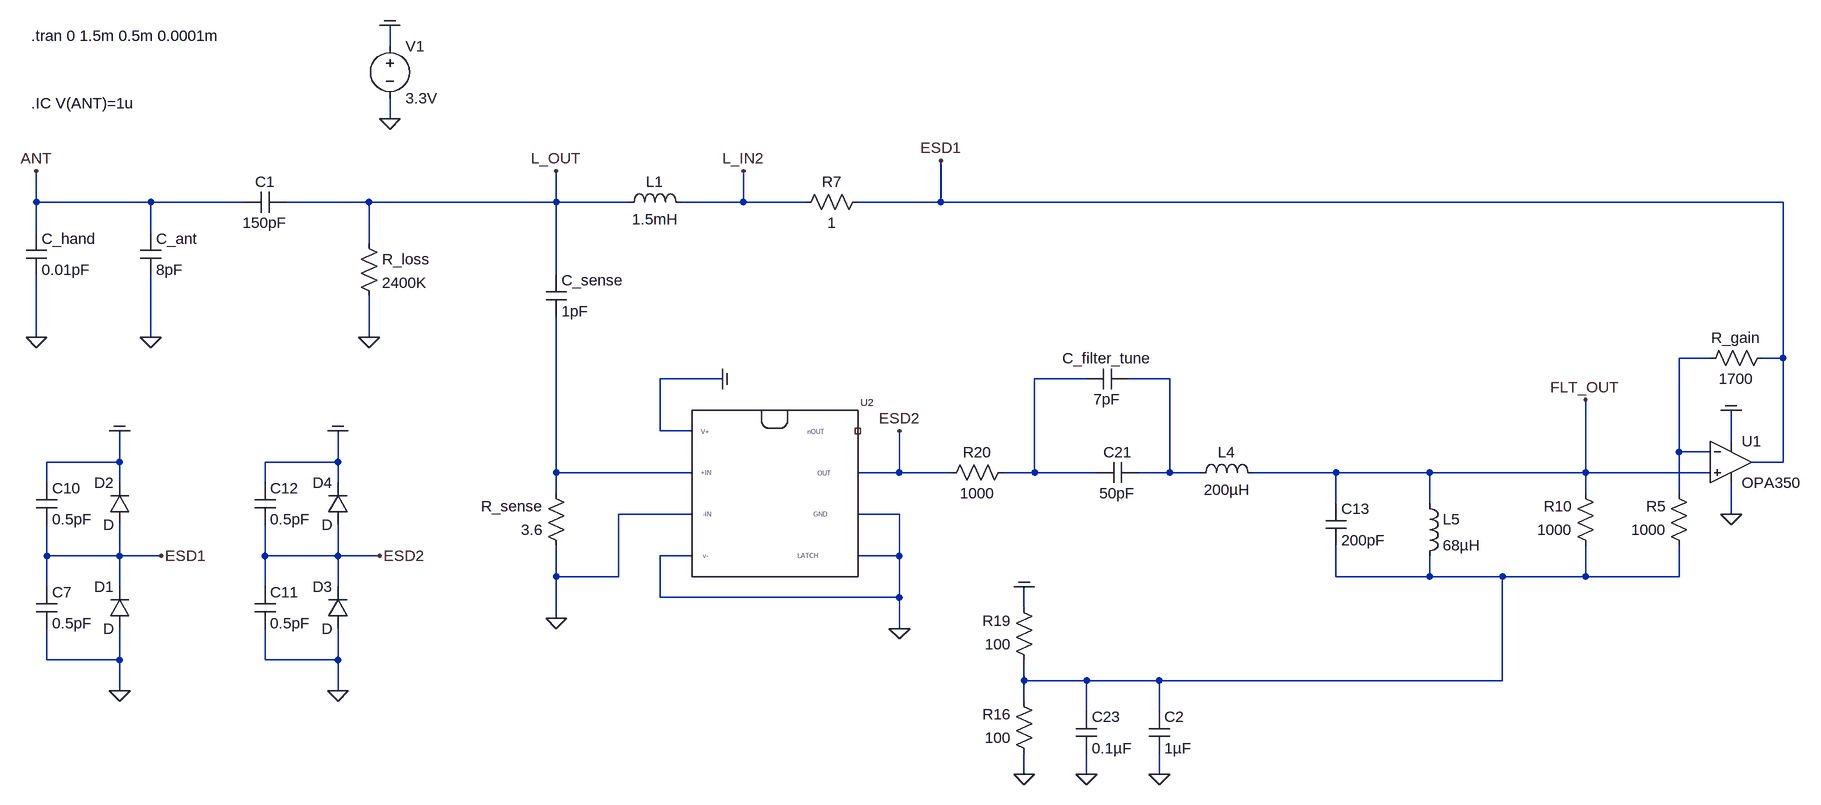
[diagram p0: schematic 2020_current_sense_sin_drive_osc_v02.asc]
2020_current_sense_sin_drive_osc_v02.asc, the LTspice schematic file:
Version 4
SHEET 1 3244 3076
WIRE -48 256 -48 224
WIRE -48 368 -48 336
WIRE -592 496 -592 448
WIRE -416 496 -592 496
WIRE -272 496 -416 496
WIRE -80 496 -208 496
WIRE 208 496 208 448
WIRE 208 496 -80 496
WIRE 320 496 208 496
WIRE 496 496 496 448
WIRE 496 496 400 496
WIRE 592 496 496 496
WIRE 800 496 800 432
WIRE 800 496 672 496
WIRE 2096 496 800 496
WIRE -592 544 -592 496
WIRE -416 544 -416 496
WIRE -80 560 -80 496
WIRE 208 608 208 496
WIRE -592 704 -592 608
WIRE -416 704 -416 608
WIRE -80 704 -80 640
WIRE 1984 736 1936 736
WIRE 2096 736 2096 496
WIRE 2096 736 2064 736
WIRE 464 768 368 768
WIRE 1024 768 944 768
WIRE 1152 768 1088 768
WIRE 368 848 368 768
WIRE 416 848 368 848
WIRE 2016 864 2016 816
WIRE 1936 880 1936 736
WIRE 1984 880 1936 880
WIRE -464 896 -464 848
WIRE -464 896 -576 896
WIRE -128 896 -128 848
WIRE -128 896 -240 896
WIRE 2096 896 2096 736
WIRE 2096 896 2048 896
WIRE 208 912 208 672
WIRE 416 912 208 912
WIRE 736 912 736 848
WIRE 736 912 672 912
WIRE 816 912 736 912
WIRE 944 912 944 768
WIRE 944 912 896 912
WIRE 1040 912 944 912
WIRE 1152 912 1152 768
WIRE 1152 912 1104 912
WIRE 1200 912 1152 912
WIRE 1408 912 1280 912
WIRE 1552 912 1408 912
WIRE 1792 912 1792 800
WIRE 1792 912 1552 912
WIRE 1984 912 1792 912
WIRE -576 928 -576 896
WIRE -464 928 -464 896
WIRE -240 928 -240 896
WIRE -128 928 -128 896
WIRE 208 944 208 912
WIRE 1792 944 1792 912
WIRE 1936 944 1936 880
WIRE 1408 960 1408 912
WIRE 1552 960 1552 912
WIRE 416 976 304 976
WIRE 736 976 672 976
WIRE 2016 976 2016 928
WIRE -576 1040 -576 992
WIRE -464 1040 -464 992
WIRE -464 1040 -576 1040
WIRE -400 1040 -464 1040
WIRE -240 1040 -240 992
WIRE -128 1040 -128 992
WIRE -128 1040 -240 1040
WIRE -64 1040 -128 1040
WIRE 416 1040 368 1040
WIRE 736 1040 736 976
WIRE 736 1040 672 1040
WIRE 208 1072 208 1024
WIRE 304 1072 304 976
WIRE 304 1072 208 1072
WIRE 1408 1072 1408 1024
WIRE 1552 1072 1552 1040
WIRE 1552 1072 1408 1072
WIRE 1664 1072 1552 1072
WIRE 1792 1072 1792 1024
WIRE 1792 1072 1664 1072
WIRE 1936 1072 1936 1024
WIRE 1936 1072 1792 1072
WIRE -576 1088 -576 1040
WIRE -464 1088 -464 1040
WIRE -240 1088 -240 1040
WIRE -128 1088 -128 1040
WIRE 368 1104 368 1040
WIRE 736 1104 736 1040
WIRE 736 1104 368 1104
WIRE 928 1120 928 1088
WIRE 208 1136 208 1072
WIRE 736 1152 736 1104
WIRE -576 1200 -576 1152
WIRE -464 1200 -464 1152
WIRE -464 1200 -576 1200
WIRE -240 1200 -240 1152
WIRE -128 1200 -128 1152
WIRE -128 1200 -240 1200
WIRE 928 1232 928 1200
WIRE 1024 1232 928 1232
WIRE 1136 1232 1024 1232
WIRE 1664 1232 1664 1072
WIRE 1664 1232 1136 1232
WIRE -464 1248 -464 1200
WIRE -128 1248 -128 1200
WIRE 928 1264 928 1232
WIRE 1024 1280 1024 1232
WIRE 1136 1280 1136 1232
WIRE 928 1376 928 1344
WIRE 1024 1376 1024 1344
WIRE 1136 1376 1136 1344
FLAG -48 368 0
FLAG -48 224 COM
FLAG -464 1248 0
FLAG -464 848 COM
FLAG -400 1040 ESD1
FLAG -128 1248 0
FLAG -128 848 COM
FLAG -64 1040 ESD2
FLAG -592 448 ANT
FLAG -592 704 0
FLAG -416 704 0
FLAG -80 704 0
FLAG 496 448 L_IN2
FLAG 208 448 L_OUT
FLAG 1792 800 FLT_OUT
FLAG 800 432 ESD1
FLAG 928 1376 0
FLAG 928 1088 COM
FLAG 1024 1376 0
FLAG 2016 816 COM
FLAG 2016 976 0
FLAG 736 1152 0
FLAG 464 768 COM
FLAG 208 1136 0
FLAG 736 848 ESD2
FLAG 1136 1376 0
SYMBOL voltage -48 240 R0
WINDOW 123 0 0 Left 0
WINDOW 39 0 0 Left 0
SYMATTR InstName V1
SYMATTR Value 3.3V
SYMBOL diode -448 1152 R180
WINDOW 0 24 64 Left 2
WINDOW 3 24 0 Left 2
SYMATTR InstName D1
SYMBOL diode -448 992 R180
WINDOW 0 24 64 Left 2
WINDOW 3 24 0 Left 2
SYMATTR InstName D2
SYMBOL cap -592 1088 R0
SYMATTR InstName C7
SYMATTR Value 0.5pF
SYMBOL cap -592 928 R0
SYMATTR InstName C10
SYMATTR Value 0.5pF
SYMBOL diode -112 1152 R180
WINDOW 0 24 64 Left 2
WINDOW 3 24 0 Left 2
SYMATTR InstName D3
SYMBOL diode -112 992 R180
WINDOW 0 24 64 Left 2
WINDOW 3 24 0 Left 2
SYMATTR InstName D4
SYMBOL cap -256 1088 R0
SYMATTR InstName C11
SYMATTR Value 0.5pF
SYMBOL cap -256 928 R0
SYMATTR InstName C12
SYMATTR Value 0.5pF
SYMBOL ind 304 512 R270
WINDOW 0 32 56 VTop 2
WINDOW 3 5 56 VBottom 2
SYMATTR InstName L1
SYMATTR Value 1.5mH
SYMATTR SpiceLine Rser=52 Rpar=20Meg
SYMBOL cap -432 544 R0
SYMATTR InstName C_ant
SYMATTR Value 8pF
SYMBOL cap -608 544 R0
SYMATTR InstName C_hand
SYMATTR Value 0.01pF
SYMBOL res -96 544 R0
SYMATTR InstName R_loss
SYMATTR Value 2400K
SYMBOL res 688 480 R90
WINDOW 0 0 56 VBottom 2
WINDOW 3 32 56 VTop 2
SYMATTR InstName R7
SYMATTR Value 1
SYMBOL cap 192 608 R0
SYMATTR InstName C_sense
SYMATTR Value 1pF
SYMBOL res 224 1040 R180
WINDOW 0 36 76 Left 2
WINDOW 3 36 40 Left 2
SYMATTR InstName R_sense
SYMATTR Value 3.6
SYMBOL cap 1104 896 R90
WINDOW 0 0 32 VBottom 2
WINDOW 3 32 32 VTop 2
SYMATTR InstName C21
SYMATTR Value 50pF
SYMBOL ind 1184 928 R270
WINDOW 0 32 56 VTop 2
WINDOW 3 5 56 VBottom 2
SYMATTR InstName L4
SYMATTR Value 200µH
SYMATTR SpiceLine Rser=6
SYMBOL res 1808 1040 R180
WINDOW 0 36 76 Left 2
WINDOW 3 36 40 Left 2
SYMATTR InstName R10
SYMATTR Value 1000
SYMBOL cap 1392 960 R0
SYMATTR InstName C13
SYMATTR Value 200pF
SYMBOL ind 1536 944 R0
SYMATTR InstName L5
SYMATTR Value 68µH
SYMATTR SpiceLine Rser=2
SYMBOL res 944 1360 R180
WINDOW 0 36 76 Left 2
WINDOW 3 36 40 Left 2
SYMATTR InstName R16
SYMATTR Value 100
SYMBOL res 944 1216 R180
WINDOW 0 36 76 Left 2
WINDOW 3 36 40 Left 2
SYMATTR InstName R19
SYMATTR Value 100
SYMBOL cap 1008 1280 R0
SYMATTR InstName C23
SYMATTR Value 0.1µF
SYMBOL res 912 896 R90
WINDOW 0 0 56 VBottom 2
WINDOW 3 32 56 VTop 2
SYMATTR InstName R20
SYMATTR Value 1000
SYMBOL res 1968 752 R270
WINDOW 0 32 56 VTop 2
WINDOW 3 0 56 VBottom 2
SYMATTR InstName R_gain
SYMATTR Value 1700
SYMBOL res 1952 1040 R180
WINDOW 0 36 76 Left 2
WINDOW 3 36 40 Left 2
SYMATTR InstName R5
SYMATTR Value 1000
SYMBOL SBORKA\\OPamp\\OPA350 2016 896 R0
SYMATTR InstName U1
SYMBOL ad8611 544 944 R0
SYMATTR InstName U2
SYMBOL cap -208 480 R90
WINDOW 0 0 32 VBottom 2
WINDOW 3 32 32 VTop 2
SYMATTR InstName C1
SYMATTR Value 150pF
SYMBOL cap 1120 1280 R0
SYMATTR InstName C2
SYMATTR Value 1µF
SYMBOL cap 1088 752 R90
WINDOW 0 0 32 VBottom 2
WINDOW 3 32 32 VTop 2
SYMATTR InstName C_filter_tune
SYMATTR Value 7pF
TEXT -600 240 Left 2 !.tran 0 1.5m 0.5m 0.0001m
TEXT -600 344 Left 2 !.IC V(ANT)=1u

The netlist it stands for:
* 2020_current_sense_sin_drive_osc_v02.asc
V1 COM 0 3.3V
D1 0 ESD1 D
D2 ESD1 COM D
C7 ESD1 0 0.5pF
C10 COM ESD1 0.5pF
D3 0 ESD2 D
D4 ESD2 COM D
C11 ESD2 0 0.5pF
C12 COM ESD2 0.5pF
L1 L_OUT L_IN2 1.5mH Rser=52 Rpar=20Meg
C_ant ANT 0 8pF
C_hand ANT 0 0.01pF
R_loss L_OUT 0 2400K
R7 ESD1 L_IN2 1
C_sense L_OUT N004 1pF
R_sense 0 N004 3.6
C21 N003 N002 50pF
L4 N003 FLT_OUT 200µH Rser=6
R10 N005 FLT_OUT 1000
C13 FLT_OUT N005 200pF
L5 FLT_OUT N005 68µH Rser=2
R16 0 N005 100
R19 N005 COM 100
C23 N005 0 0.1µF
R20 N002 ESD2 1000
R_gain N001 ESD1 1700
R5 N005 N001 1000
* U1: OPA350 (symbol SBORKA\OPamp\OPA350 not available, pins judged from their places): In+=FLT_OUT In-=N001 V+=COM V-=0 OUT=ESD1
XU2 N004 0 COM 0 0 0 ESD2 NC_01 ad8611  ; pins +IN -IN V+ V- Latch GND OUT nOUT
C1 L_OUT ANT 150pF
C2 N005 0 1µF
C_filter_tune N003 N002 7pF
.model D D
.lib standard.dio
.tran 0 1.5m 0.5m 0.0001m
.IC V(ANT)=1u
.lib AD8611.cir
.backanno
.end